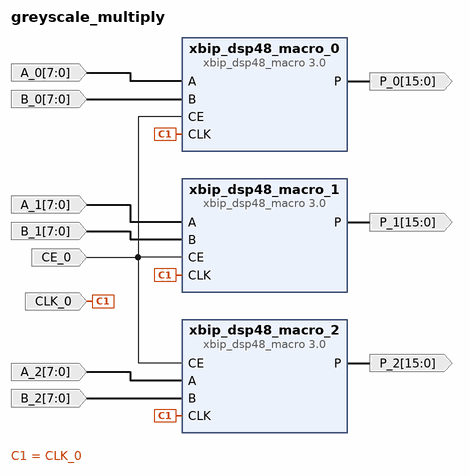
[diagram p0: block diagram of the top level]
# Vivado block design greyscale_multiply, xc7a50tcsg324-1, Vivado 2019.2
create_bd_design greyscale_multiply

create_bd_port -dir I -from 7 -to 0 -type data A_0
create_bd_port -dir I -from 7 -to 0 -type data A_1
create_bd_port -dir I -from 7 -to 0 -type data A_2
create_bd_port -dir I -from 7 -to 0 -type data B_0
create_bd_port -dir I -from 7 -to 0 -type data B_1
create_bd_port -dir I -from 7 -to 0 -type data B_2
create_bd_port -dir I -type clk CLK_0
create_bd_port -dir O -from 15 -to 0 -type data P_0
create_bd_port -dir O -from 15 -to 0 -type data P_1
create_bd_port -dir O -from 15 -to 0 -type data P_2
create_bd_port -dir I -type ce CE_0

create_bd_cell -type ip -vlnv xilinx.com:ip:xbip_dsp48_macro:3.0 xbip_dsp48_macro_0
set_property -dict [list \
  CONFIG.a_width 8 \
  CONFIG.areg_3 true \
  CONFIG.areg_4 true \
  CONFIG.b_width 8 \
  CONFIG.breg_3 true \
  CONFIG.breg_4 true \
  CONFIG.creg_3 false \
  CONFIG.creg_4 false \
  CONFIG.creg_5 false \
  CONFIG.has_ce true \
  CONFIG.instruction1 {A*B} \
  CONFIG.mreg_5 true \
  CONFIG.p_binarywidth 0 \
  CONFIG.p_full_width 16 \
  CONFIG.p_width 16 \
  CONFIG.preg_6 true \
] [get_bd_cells xbip_dsp48_macro_0]
create_bd_cell -type ip -vlnv xilinx.com:ip:xbip_dsp48_macro:3.0 xbip_dsp48_macro_1
set_property -dict [list \
  CONFIG.a_width 8 \
  CONFIG.areg_3 true \
  CONFIG.areg_4 true \
  CONFIG.b_width 8 \
  CONFIG.breg_3 true \
  CONFIG.breg_4 true \
  CONFIG.creg_3 false \
  CONFIG.creg_4 false \
  CONFIG.creg_5 false \
  CONFIG.has_ce true \
  CONFIG.instruction1 {A*B} \
  CONFIG.mreg_5 true \
  CONFIG.p_binarywidth 0 \
  CONFIG.p_full_width 16 \
  CONFIG.p_width 16 \
  CONFIG.preg_6 true \
] [get_bd_cells xbip_dsp48_macro_1]
create_bd_cell -type ip -vlnv xilinx.com:ip:xbip_dsp48_macro:3.0 xbip_dsp48_macro_2
set_property -dict [list \
  CONFIG.a_width 8 \
  CONFIG.areg_3 true \
  CONFIG.areg_4 true \
  CONFIG.b_width 8 \
  CONFIG.breg_3 true \
  CONFIG.breg_4 true \
  CONFIG.creg_3 false \
  CONFIG.creg_4 false \
  CONFIG.creg_5 false \
  CONFIG.has_ce true \
  CONFIG.instruction1 {A*B} \
  CONFIG.mreg_5 true \
  CONFIG.p_binarywidth 0 \
  CONFIG.p_full_width 16 \
  CONFIG.p_width 16 \
  CONFIG.preg_6 true \
] [get_bd_cells xbip_dsp48_macro_2]

# ---- connections ----

connect_bd_net [get_bd_pins xbip_dsp48_macro_2/P] [get_bd_ports P_2]
connect_bd_net [get_bd_pins xbip_dsp48_macro_1/P] [get_bd_ports P_1]
connect_bd_net [get_bd_pins xbip_dsp48_macro_0/P] [get_bd_ports P_0]
connect_bd_net -net A_0_1 [get_bd_ports A_0] [get_bd_pins xbip_dsp48_macro_0/A]
connect_bd_net -net B_0_1 [get_bd_ports B_0] [get_bd_pins xbip_dsp48_macro_0/B]
connect_bd_net -net A_1_1 [get_bd_ports A_1] [get_bd_pins xbip_dsp48_macro_1/A]
connect_bd_net -net B_1_1 [get_bd_ports B_1] [get_bd_pins xbip_dsp48_macro_1/B]
connect_bd_net -net CLK_0_1 [get_bd_ports CLK_0] \
  [get_bd_pins xbip_dsp48_macro_1/CLK] [get_bd_pins xbip_dsp48_macro_0/CLK] [get_bd_pins xbip_dsp48_macro_2/CLK]
connect_bd_net -net A_2_1 [get_bd_ports A_2] [get_bd_pins xbip_dsp48_macro_2/A]
connect_bd_net -net B_2_1 [get_bd_ports B_2] [get_bd_pins xbip_dsp48_macro_2/B]
connect_bd_net -net CE_0_1 [get_bd_ports CE_0] \
  [get_bd_pins xbip_dsp48_macro_2/CE] [get_bd_pins xbip_dsp48_macro_1/CE] [get_bd_pins xbip_dsp48_macro_0/CE]

validate_bd_design
save_bd_design
